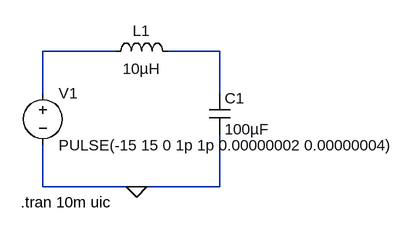
[diagram p0: schematic ripple-test-formula.asc]
ripple-test-formula.asc, the LTspice schematic file:
Version 4
SHEET 1 880 680
WIRE 208 80 96 80
WIRE 368 80 288 80
WIRE 96 144 96 80
WIRE 368 144 368 80
WIRE 96 288 96 224
WIRE 240 288 96 288
WIRE 368 288 368 208
WIRE 368 288 240 288
FLAG 240 288 0
SYMBOL voltage 96 128 R0
WINDOW 123 0 0 Left 0
WINDOW 39 0 0 Left 0
SYMATTR InstName V1
SYMATTR Value PULSE(-15 15 0 1p 1p 0.00000002 0.00000004)
SYMBOL ind 192 96 R270
WINDOW 0 32 56 VTop 2
WINDOW 3 5 56 VBottom 2
SYMATTR InstName L1
SYMATTR Value 10µH
SYMATTR SpiceLine Rser=1
SYMBOL cap 352 144 R0
SYMATTR InstName C1
SYMATTR Value 100µF
TEXT 62 312 Left 2 !.tran 10m uic

The netlist it stands for:
* ripple-test-formula.asc
V1 N001 0 PULSE(-15 15 0 1p 1p 0.00000002 0.00000004)
L1 N001 N002 10µH Rser=1
C1 N002 0 100µF
.tran 10m uic
.backanno
.end